# EAGLE design SCS_V2 (EAGLE 9.3.0)
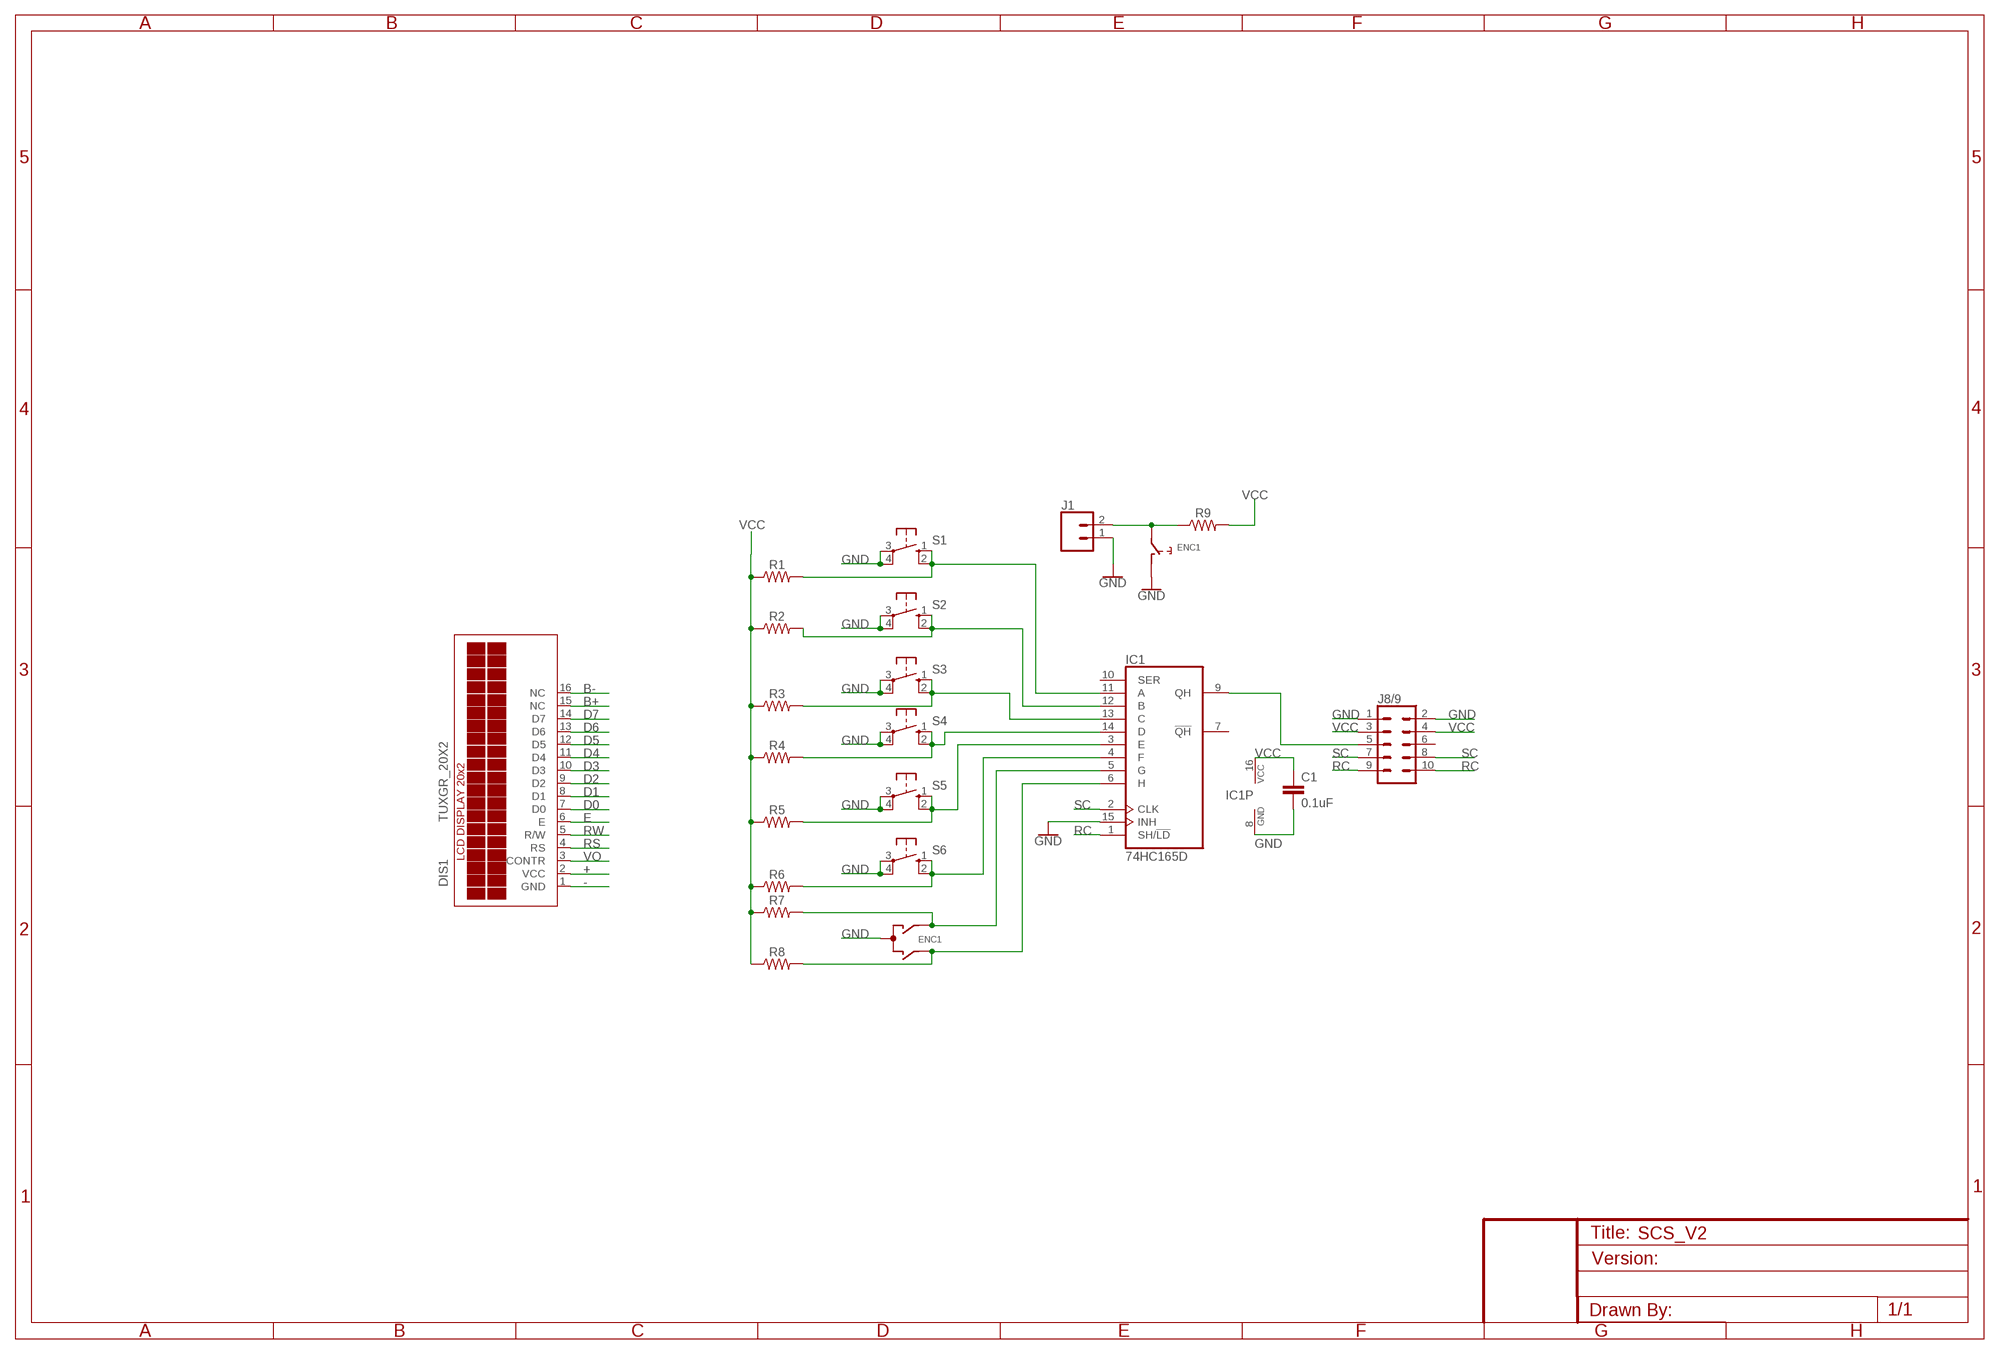
[diagram p0: schematic, sheet 1]

## Parts
C1  0.1uF  0.1UF-0603-25V-(+80/-20%)  [0603]
DIS1  TUXGR_20X2  [TUXGR_20X2]
ENC1  EC12E_SW  [ALPS_EC12E_SW]
IC1  74HC165D  [SO16]
J1  CONN_02  [1X02]
J8/9  CONN_05X2SHD_LOCK  [2X5-SHROUDED_LOCK]
R1  10k  10KOHM-0603-1/10W-1%  [0603]
R2  10k  10KOHM-0603-1/10W-1%  [0603]
R3  10k  10KOHM-0603-1/10W-1%  [0603]
R4  10k  10KOHM-0603-1/10W-1%  [0603]
R5  10k  10KOHM-0603-1/10W-1%  [0603]
R6  10k  10KOHM-0603-1/10W-1%  [0603]
R7  10k  10KOHM-0603-1/10W-1%  [0603]
R8  10k  10KOHM-0603-1/10W-1%  [0603]
R9  10k  10KOHM-0603-1/10W-1%  [0603]
S1  40-XX  [B3F-40XX]
S2  40-XX  [B3F-40XX]
S3  40-XX  [B3F-40XX]
S4  40-XX  [B3F-40XX]
S5  40-XX  [B3F-40XX]
S6  40-XX  [B3F-40XX]

## Nets
+: DIS1.2(VCC)
-: DIS1.1(GND)
B+: DIS1.15(NC)
B-: DIS1.16(NC)
D0: DIS1.7(D0)
D1: DIS1.8(D1)
D2: DIS1.9(D2)
D3: DIS1.10(D3)
D4: DIS1.11(D4)
D5: DIS1.12(D5)
D6: DIS1.13(D6)
D7: DIS1.14(D7)
E: DIS1.6(E)
GND: C1.2 ENC1.C ENC1.D IC1.8(GND) IC1.15(INH) J1.1 J8/9.1 J8/9.2 S1.3(P) S1.4(P1) S2.3(P) S2.4(P1) S3.3(P) S3.4(P1) S4.3(P) S4.4(P1) S5.3(P) S5.4(P1) S6.3(P) S6.4(P1)
N$1: IC1.3(E) R5.2 S5.1(S) S5.2(S1)
N$2: ENC1.A IC1.5(G) R7.2
N$3: IC1.4(F) R6.2 S6.1(S) S6.2(S1)
N$4: IC1.9(QH) J8/9.5
N$5: IC1.14(D) R4.2 S4.1(S) S4.2(S1)
N$6: IC1.13(C) R3.2 S3.1(S) S3.2(S1)
N$7: IC1.12(B) R2.2 S2.1(S) S2.2(S1)
N$8: IC1.11(A) R1.2 S1.1(S) S1.2(S1)
N$9: ENC1.B IC1.6(H) R8.2
N$11: ENC1.E J1.2 R9.1
RC: IC1.1(SH/!LD) J8/9.9 J8/9.10
RS: DIS1.4(RS)
RW: DIS1.5(R/W)
SC: IC1.2(CLK) J8/9.7 J8/9.8
VCC: C1.1 IC1.16(VCC) J8/9.3 J8/9.4 R1.1 R2.1 R3.1 R4.1 R5.1 R6.1 R7.1 R8.1 R9.2
VO: DIS1.3(CONTR)
Unconnected: ENC1.GND1(G) ENC1.GND2(G) IC1.7(!QH) IC1.10(SER) J8/9.6

## Library data of the parts
C1 = SparkFun-Capacitors:0.1UF: 0.1µF ceramic capacitors A capacitor is a passive two-terminal electrical component used to store electrical energy temporarily in an electric field.; PROD_ID: CAP-00810
DIS1 = display-lcd:TUXGR_20X2: Tuxgraphics LCD display 20x2 characters reflective, without background light Source: tuxgr_20x2.pdf; OC_FARNELL: unknown; OC_NEWARK: unknown
ENC1 = switch-alps:EC12E_SW: ALPS rotary Encoder EC12E series with switch; MPN: EC12E2424407; OC_FARNELL: 1520813; OC_NEWARK: 74M1068
IC1 = 74xx-eu:74*165: 8-bit parallel load SHIFT REGISTER
J1 = SparkFun-Connectors:CONN_02: Multi connection point. Often used as Generic Header-pin footprint for 0.1 inch spaced/style header connections On any of the 0.1 inch spaced packages, you can populate with these: Break Away Headers - Straight <https://www.sparkfun.com/products/116> (PRT-00116) Break Away Male Headers - Right Angle <https://www.sparkfun.com/products/553> (PRT-00553) Female Headers <https://www.sparkfun.com/products/115> (PRT-00115) Break Away Headers - Machine Pin <https://www.sparkfun.com/products/117> (PRT-00117) Break Away Female Headers - Swiss Machine Pin <https://www.sparkfun.com/products/743> (PRT-00743) For SCREWTERMINALS and SPRING TERMINALS visit here: Screw Terimnals on SparkFun.com <https://www.sparkfun.com/search/results?term=Screw+Terminals> (5mm/3.5mm/2.54mm spacing) This device is also useful as a general connection point to wire up your design to another part of your project. Our various solder wires solder well into these plated through hole pads. Hook-Up Wire - Assortment (Stranded, 22 AWG) <https://www.sparkfun.com/products/11375> (PRT-11375) Hook-Up Wire - Assortment (Solid Core, 22 AWG) <https://www.sparkfun.com/products/11367> (PRT-11367) View the entire wire category on our website here <https://www.sparkfun.com/categories/141> Special notes: Molex polarized connector foot print use with: PRT-08233 with associated crimp pins and housings. 2.54_SCREWTERM for use with PRT-10571. 3.5mm Screw Terminal footprints for PRT-08084 5mm Screw Terminal footprints for use with PRT-08432
J8/9 = SparkFun-Connectors:CONN_05X2: Multi connection point. Often used as Generic Header-pin footprint for 0.1 inch spaced/style header connections For AVR SPI programming port, see special device with nice symbol: "AVR_SPI_PROG_5x2.dev" You can populate with any combo of single row headers, but if you'd like an exact match, check these: 2x5 AVR ICSP Male Header <https://www.sparkfun.com/products/778> (PRT-00778) 2x5 Pin Shrouded Header <https://www.sparkfun.com/products/8506> (PRT-08506) On any of the 0.1 inch spaced packages, you can populate with these: Break Away Headers - Straight <https://www.sparkfun.com/products/116> (PRT-00116) Break Away Male Headers - Right Angle <https://www.sparkfun.com/products/553> (PRT-00553) Female Headers <https://www.sparkfun.com/products/115> (PRT-00115) Break Away Headers - Machine Pin <https://www.sparkfun.com/products/117> (PRT-00117) Break Away Female Headers - Swiss Machine Pin <https://www.sparkfun.com/products/743> (PRT-00743) Special note: the shrouded connector mates well with our 5x2 ribbon cables: 2x5 Pin IDC Ribbon Cable <https://www.sparkfun.com/products/8535> (PRT-08535); PROD_ID: CONN-08671; SF_ID: PRT-08506
R1-R9 = SparkFun-Resistors:10KOHM: 10kΩ resistor A resistor is a passive two-terminal electrical component that implements electrical resistance as a circuit element. Resistors act to reduce current flow, and, at the same time, act to lower voltage levels within circuits. - Wikipedia; PROD_ID: RES-00824
S1-S6 = adafruit:40-XX: OMRON SWITCH; MF: OMRON COMPONENTS USA; MPN: B3F-4000; OC_FARNELL: 176434; OC_NEWARK: 36K3105

## Net classes
0 default: width 0.508 mm, drill 0.508 mm, clearance 0.508 mm

## Board
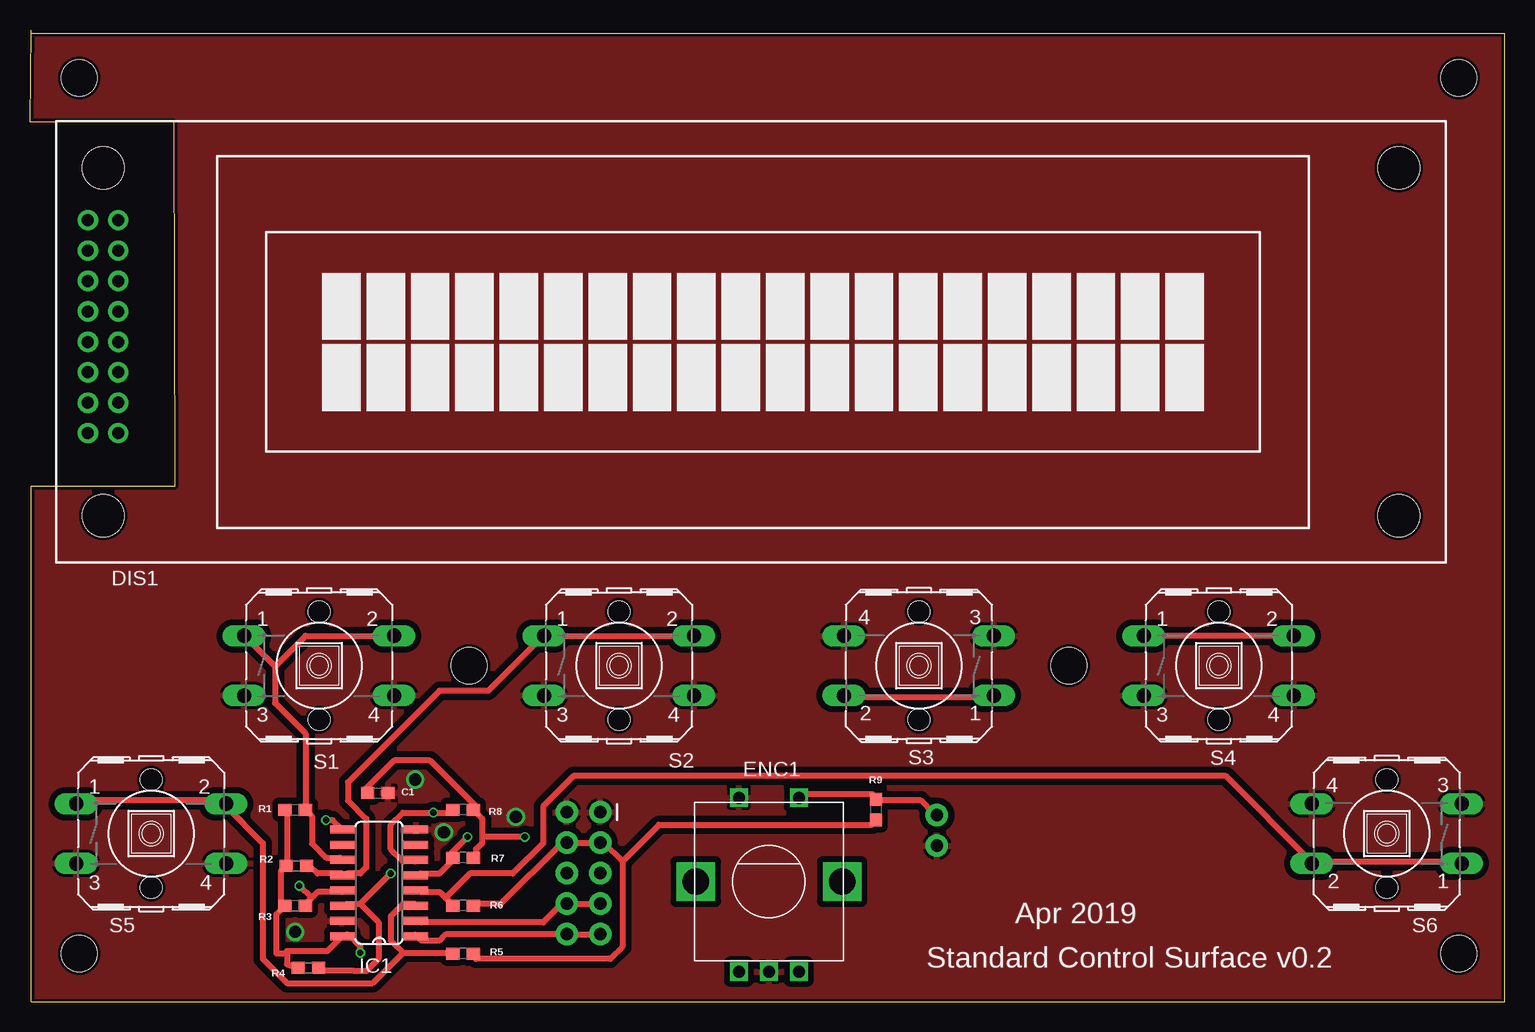
[diagram p1: board, top side]
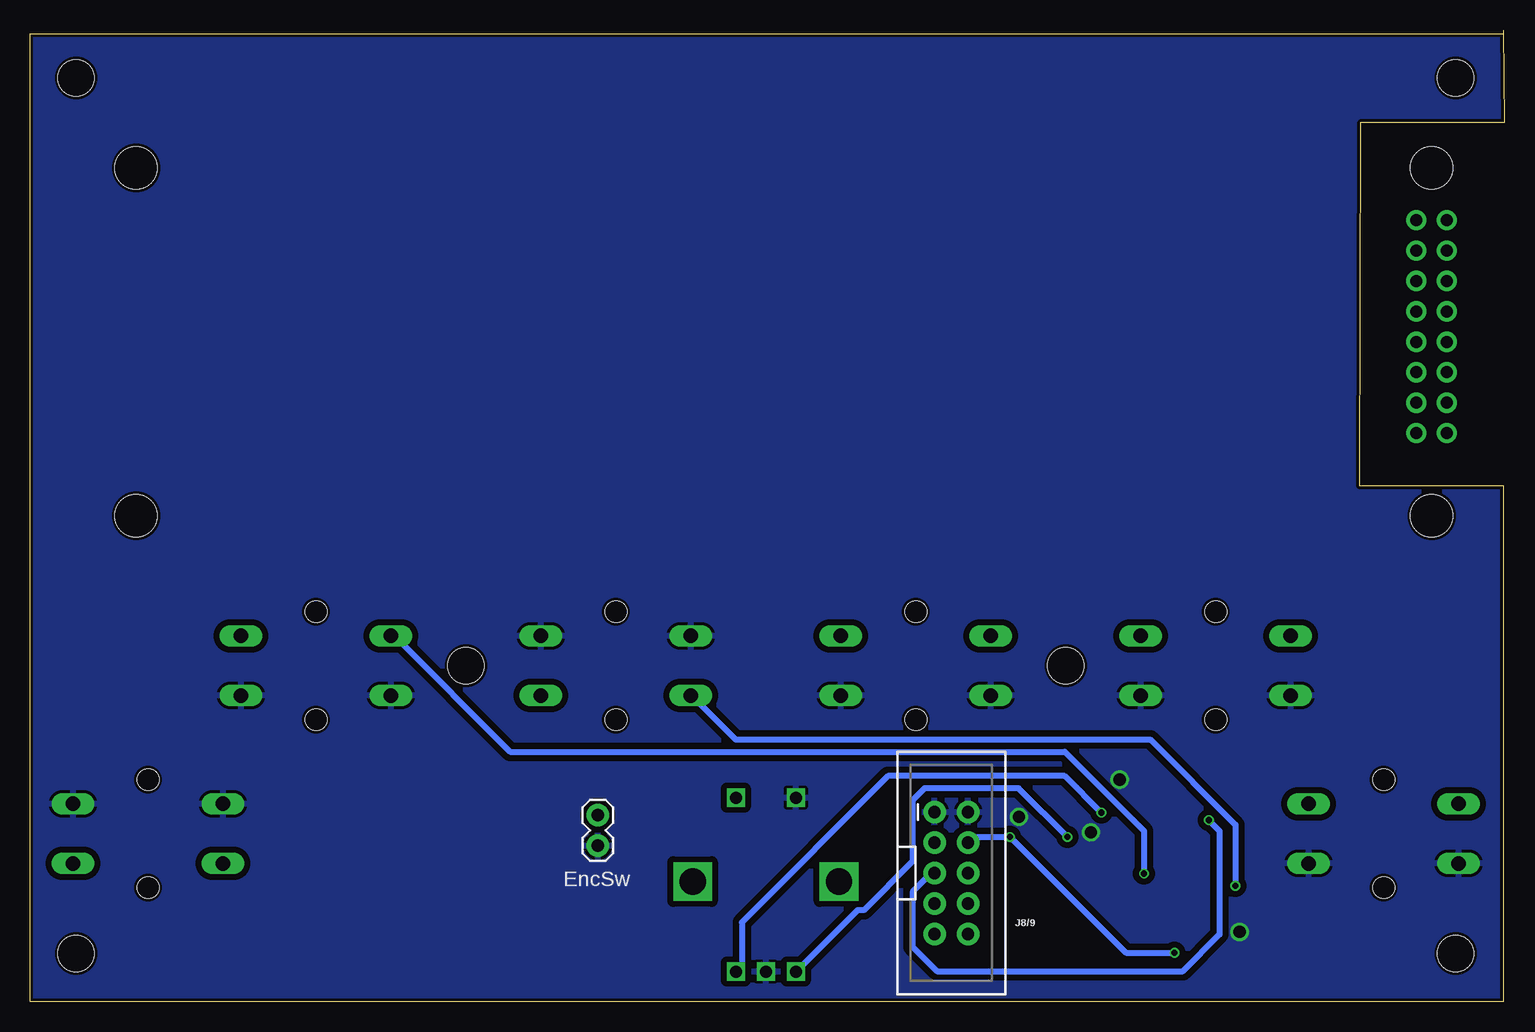
[diagram p2: board, bottom side, seen from below]

Size 122.94 x 81 mm. Coordinates in mm from the lower left corner, seen from the top.
Outline: 0.1,80.68 122.94,80.68 122.94,0 0.1,0 0.1,43 12.1,43 12,73.3 0,73.3 0.1,81
Copper layers (1*16): Top 0.035mm / dielectric 1.5mm / Bottom 0.035mm
Design rules "dirt_cheap_dirty_boards.v1.1": minimum track width 6mil, minimum drill 12mil, track to track 6mil, track to pad 6mil, pad to pad 6mil, via to via 6mil, smd to smd 0mil, copper to edge 10mil, drill to drill 10mil, minimum pad ring 10mil, minimum via ring 6mil, stop-mask expansion 2mil, vias tented up to drill 25mil, thermal gap 10mil
Holes 3 mm at 4.1,77 119.1,77 119.1,4 4.1,4 36.6,28 86.6,28

### Footprints (pad centres in the part's own frame; a part is rotated, then mirrored left to right if it is on the bottom)
0603 = smd 1.1 x 1: 1 -0.85,0; 2 0.85,0
TUXGR_20X2 = drill 1 pad 1.676: 1 -52.73,-7.62; 2 -55.27,-7.62; 3 -52.73,-5.08; 4 -55.27,-5.08; 5 -52.73,-2.54; 6 -55.27,-2.54; 7 -52.73,0; 8 -55.27,0; 9 -52.73,2.54; 10 -55.27,2.54; 11 -52.73,5.08; 12 -55.27,5.08; 13 -52.73,7.62; 14 -55.27,7.62; 15 -52.73,10.16; 16 -55.27,10.16 | hole 3.5: -54,-14.5; 54,-14.5; -54,14.5; 54,14.5
ALPS_EC12E_SW = drill 1 square: A -2.5,-7.5; B 2.5,-7.5; C 0,-7.5; D -2.5,7; E 2.5,7 | drill 2.2 square: GND1 -6.1,0; GND2 6.1,0
SO16 = smd 0.66 x 2.032: 1 -4.445,-3.073; 2 -3.175,-3.073; 3 -1.905,-3.073; 4 -0.635,-3.073; 5 0.635,-3.073; 6 1.905,-3.073; 7 3.175,-3.073; 8 4.445,-3.073; 9 4.445,3.073; 10 3.175,3.073; 11 1.905,3.073; 12 0.635,3.073; 13 -0.635,3.073; 14 -1.905,3.073; 15 -3.175,3.073; 16 -4.445,3.073
1X02 = drill 1.016 pad 1.88: 1 0,0; 2 2.54,0
2X5-SHROUDED_LOCK = drill 1.016 pad 1.88: 1 -1.397,5.08; 2 1.397,5.08; 3 -1.397,2.54; 4 1.397,2.54; 5 -1.397,0; 6 1.397,0; 7 -1.397,-2.54; 8 1.397,-2.54; 9 -1.397,-5.08; 10 1.397,-5.08
B3F-40XX = drill 1.194 long: 1 -6.248,2.489; 2 6.248,2.489; 3 -6.248,-2.489; 4 6.248,-2.489 | hole 1.803: 0,-4.496; 0,4.496

### Placement (x,y rotation side)
C1  29,17.4 0 top
DIS1  60.1,55 0 top
ENC1  61.6,10 0 top
IC1  29.1,9.9 90 top
J1  75.6,13 90 bottom
J8/9  46.14,10.71 0 bottom
R1  22.1,16 0 top
R2  22.2,11.3 0 top
R3  22.1,8 0 top
R4  23.2,2.8 0 top
R5  36.1,4 180 top
R6  36.1,8 180 top
R7  36.1,12 180 top
R8  36.1,16 180 top
R9  70.5,16 270 top
S1  24.1,28 0 top
S2  49.1,28 0 top
S3  74.1,28 180 top
S4  99.1,28 0 top
S5  10.1,14 0 top
S6  113.1,14 180 top

### Tracks (layer width: path | path; a pad name or v marks a point on that pad's centre or on a via)
GND  (via drill 1.02)
  other vias: 40.5,15.4 34.5,14.1 32.1,18.5 22.1,5.8
  pour Top: -1.9,86 130.1,86 130.1,-6 -1.9,-6
  pour Bottom: -1.9,86 130.1,86 130.1,-6 -1.9,-6
N$1
  Top 0.508: 31.09,4.06 35.15,4.06 R5.2 | 31.09,4.06 30.07,5.08 30.07,7.11 31.09,8.13 32.1,8.13 IC1.3 | S5.1 4.16,16.76 15.85,16.76 S5.2 16.36,16.26 19.4,13.21 19.4,3.56 21.44,1.52 28.55,1.52 31.09,4.06
N$2  (via drill 0.51)
  Top 0.508: IC1.5 32.61,10.67 34.14,10.67 35.15,11.68 R7.2 35.15,12.19 35.15,12.4 v36.47,13.72
  Bottom 0.508: v36.47,13.72 40.53,17.78 48.36,17.78 49.38,16.76 49.38,11.68 53.44,7.62 53.95,7.62 59.03,2.54 ENC1.A
N$3
  Top 0.508: 34.64,8.64 34.14,9.14 32.61,9.14 IC1.4 | 34.64,8.64 35.15,8.13 R6.2 | 34.64,8.64 36.68,10.67 40.23,10.67 42.77,13.21 42.77,16.26 45.31,18.8 99.67,18.8 106.78,11.68 S6.2 107.29,11.68 118.97,11.68 S6.1
N$4  (via drill 0.51)
  Top 0.508: IC1.9 25.25,15.12 v24.68,15.12
  Bottom 0.508: v24.68,15.12 23.78,14.22 23.78,5.59 26.82,2.54 47.34,2.54 49.38,4.57 49.38,9.14 47.85,10.67 J8/9.5
N$5  (via drill 0.51)
  Top 0.508: R4.2 24.29,2.56 27.01,2.56 27.02,2.54 28.04,2.54 29.06,3.56 29.06,6.6 27.53,8.13 | 27.53,8.13 26.52,8.13 IC1.14 | S4.1 93.06,30.48 105.26,30.48 S4.2 | v30.07,10.67 27.53,8.13
  Bottom 0.508: v30.07,10.67 30.07,14.22 36.68,20.83 82.9,20.83 92.56,30.48 S4.1
N$6  (via drill 0.51)
  Top 0.508: 23.47,8.64 23.98,9.14 26.01,9.14 IC1.13 | 23.47,8.64 22.96,8.13 R3.2 | v22.45,9.65 23.47,8.64 | S3.1 79.86,25.4 68.17,25.4 S3.2
  Bottom 0.508: v22.45,9.65 22.45,14.73 29.56,21.84 64.11,21.84 67.66,25.4 S3.2
N$7
  Top 0.508: R2.2 23.35,11.29 23.98,10.67 26.01,10.67 IC1.12 26.52,10.67 27.53,10.67 28.04,11.18 28.04,15.24 26.52,16.76 26.52,18.29 34.14,25.91 38.2,25.91 42.77,30.48 S2.1 43.28,30.48 54.96,30.48 S2.2
N$8
  Top 0.508: 20.42,27.94 20.42,24.89 22.96,22.35 22.96,16.26 R1.2 23.51,15.44 23.51,13.17 24.7,11.98 25.85,11.98 IC1.11 | 20.42,27.94 17.88,30.48 S1.1 | 20.42,27.94 22.96,30.48 30.07,30.48 S1.2
N$9  (via drill 0.51)
  Top 0.508: R8.2 35.15,15.75 v33.63,15.75 31.09,15.75 30.07,14.73 30.07,12.7 31.09,11.68 32.1,11.68 IC1.6
  Bottom 0.508: v33.63,15.75 36.68,18.8 51.41,18.8 63.6,6.6 63.6,2.54 ENC1.B
N$11
  Top 0.508: J1.2 75.28,15.75 74.27,16.76 70.71,16.76 R9.1 70.2,17.27 64.11,17.27 ENC1.E
RC
  Top 0.508: IC1.1 32.1,5.59 32.61,5.08 34.14,5.08 34.64,5.59 44.3,5.59 J8/9.10 44.8,5.59 47.34,5.59 J8/9.9
SC
  Top 0.508: IC1.2 32.61,6.6 42.77,6.6 44.3,8.13 J8/9.8 44.8,8.13 47.34,8.13 J8/9.7
VCC  (via drill 0.51)
  Top 0.508: R1.1 21.44,15.75 21.44,11.39 R2.1 20.93,10.89 20.93,8.13 R3.1 20.54,7.29 20.54,3.99 21.44,3.99 | 21.44,3.99 21.44,4.19 24.76,4.19 IC1.16 26.52,5.59 27.53,4.57 v27.53,4.06 | 21.44,3.99 21.44,3.11 R4.1 | 37.69,13.72 37.69,15.24 36.99,16 R8.1 37.18,16.26 33.34,20.1 30.36,20.1 28.04,17.78 C1.1 | 37.69,13.72 37.69,13.21 37.18,12.7 37.18,12.19 R7.1 | R6.1 37.18,8.13 39.22,8.13 44.3,13.21 J8/9.4 44.8,13.21 47.34,13.21 J8/9.3 47.85,13.21 49.38,11.68 | v41.25,13.72 37.69,13.72 | 49.38,11.68 49.38,4.57 48.36,3.56 37.18,3.56 R5.1 | 49.38,11.68 52.42,14.73 70.2,14.73 R9.2
  Bottom 0.508: J8/9.4 44.3,13.72 v41.25,13.72 31.6,4.06 v27.53,4.06

### Text on the board
tPlace: Apr 2019 | Standard Control Surface v0.2
bPlace: EncSw